# EAGLE design Tasmota_ESP32C6-6c (EAGLE 9.6.2)

## Sheet 1 of 8
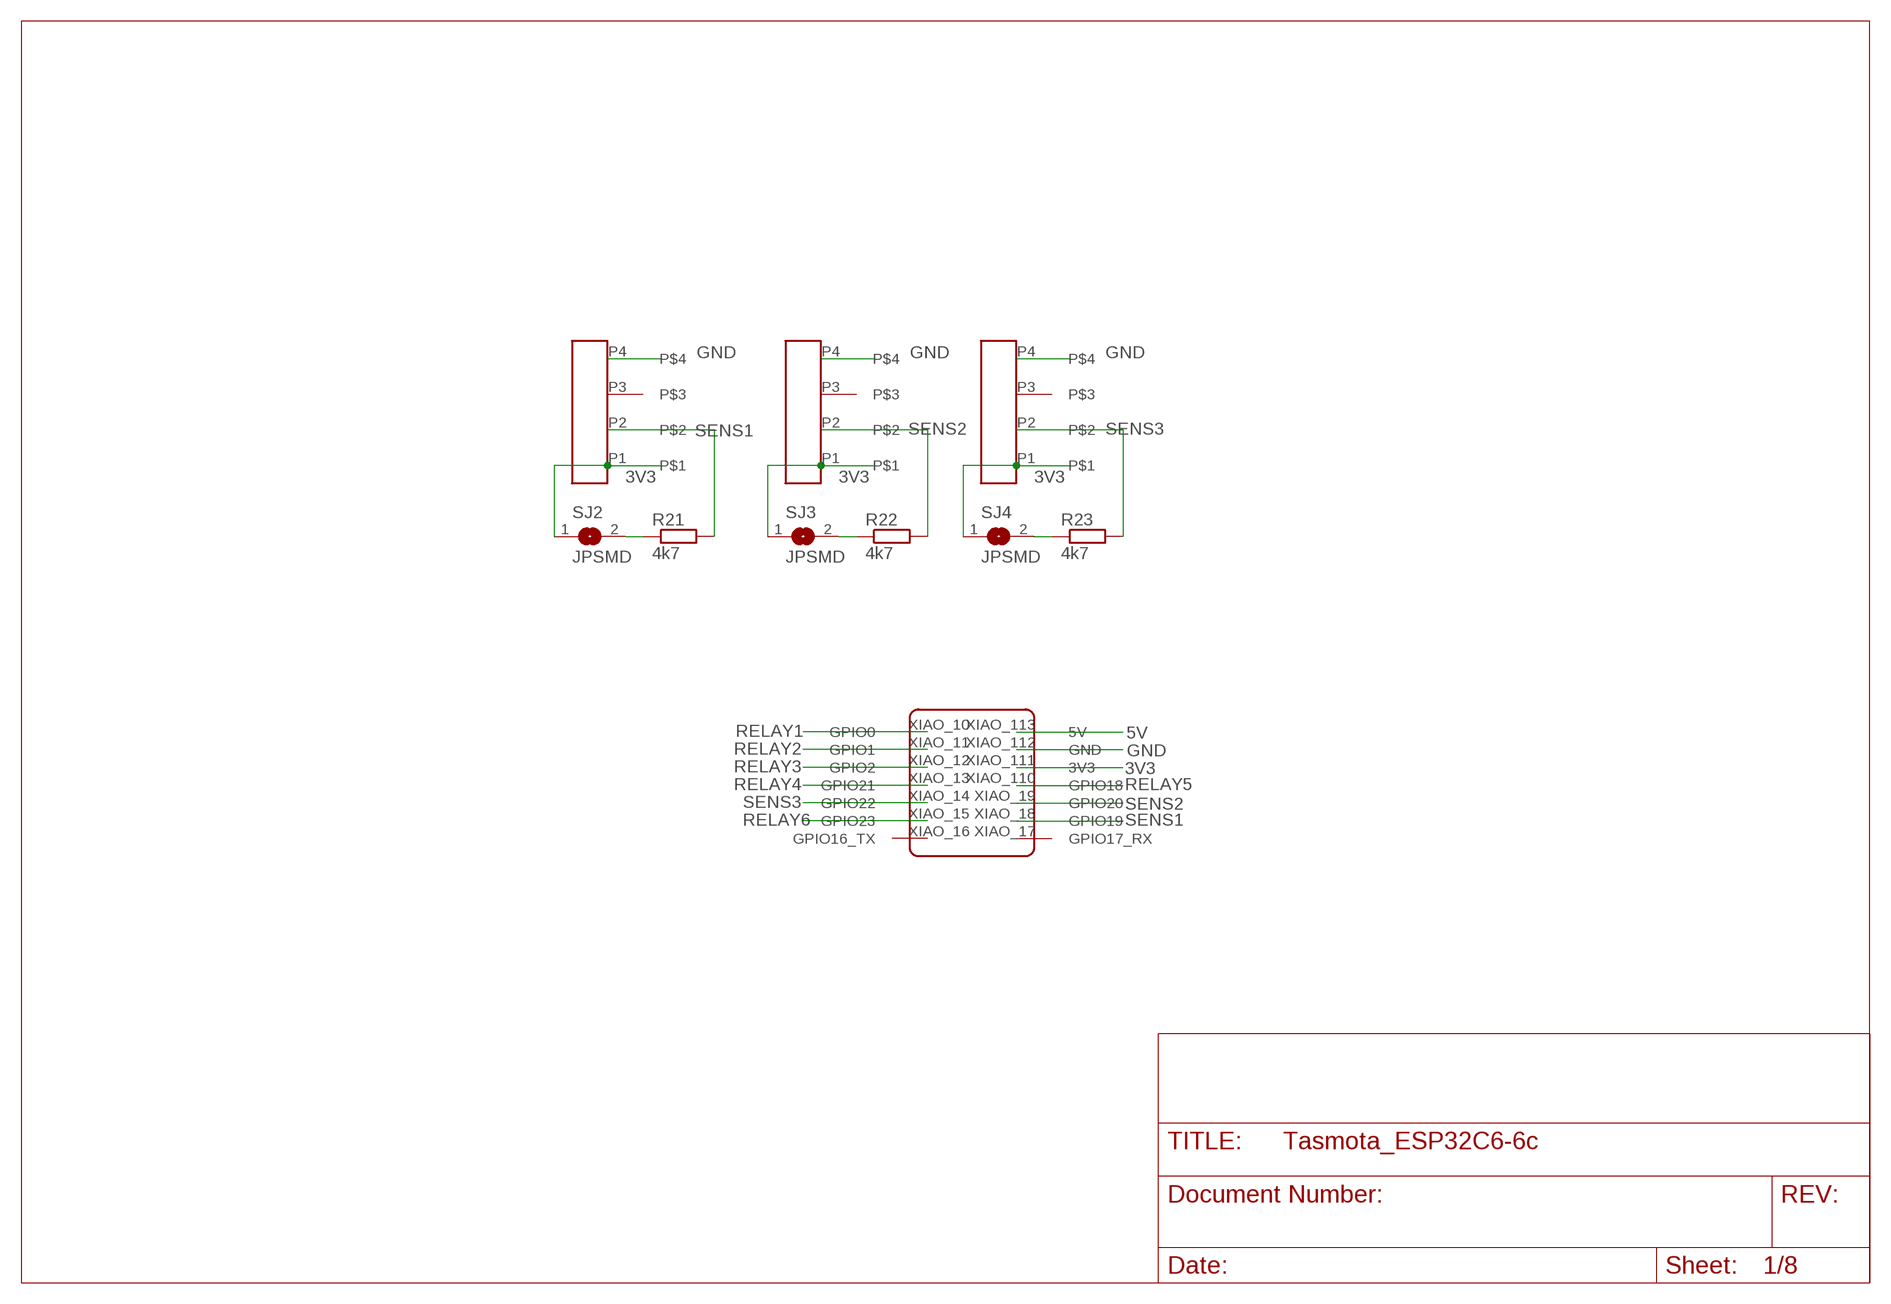
[diagram p0: schematic, sheet 1]

### Parts
R21  4k7  R-EU_R0805  [R0805]
R22  4k7  R-EU_R0805  [R0805]
R23  4k7  R-EU_R0805  [R0805]
SENSOR1  GMX-N-44  GMX-N-4  [GMX-N-4]
SENSOR2  GMX-N-44  GMX-N-4  [GMX-N-4]
SENSOR3  GMX-N-44  GMX-N-4  [GMX-N-4]
SJ2  JPSMD  SJ  [SJ]
SJ3  JPSMD  SJ  [SJ]
SJ4  JPSMD  SJ  [SJ]
U$1  1x7P  XIAO_ESP32C6  [XIAO_ESP32C6]

### Nets
3V3 [pwr]: SENSOR1.P1 SENSOR2.P1 SENSOR3.P1 SJ2.1 SJ3.1 SJ4.1 U$1.XIAO_111(3V3)
5V [pwr]: U$1.XIAO_113(5V) ; also sheet 2,3,4,5,6,7,8
GND [pwr]: SENSOR1.P4 SENSOR2.P4 SENSOR3.P4 U$1.XIAO_112(GND) ; also sheet 2,3,4,5,6,7,8
N$4: R21.1 SJ2.2
N$5: R22.1 SJ3.2
N$10: R23.1 SJ4.2
RELAY1: U$1.XIAO_10(GPIO0) ; also sheet 3
RELAY2: U$1.XIAO_11(GPIO1) ; also sheet 4
RELAY3: U$1.XIAO_12(GPIO2) ; also sheet 5
RELAY4: U$1.XIAO_13(GPIO21) ; also sheet 6
RELAY5: U$1.XIAO_110(GPIO18) ; also sheet 7
RELAY6: U$1.XIAO_15(GPIO23) ; also sheet 8
SENS1: R21.2 SENSOR1.P2 U$1.XIAO_18(GPIO19)
SENS2: R22.2 SENSOR2.P2 U$1.XIAO_19(GPIO20)
SENS3: R23.2 SENSOR3.P2 U$1.XIAO_14(GPIO22)
Unconnected: SENSOR1.P3 SENSOR2.P3 SENSOR3.P3 U$1.XIAO_16(GPIO16_TX) U$1.XIAO_17(GPIO17_RX)

## Sheet 2 of 8
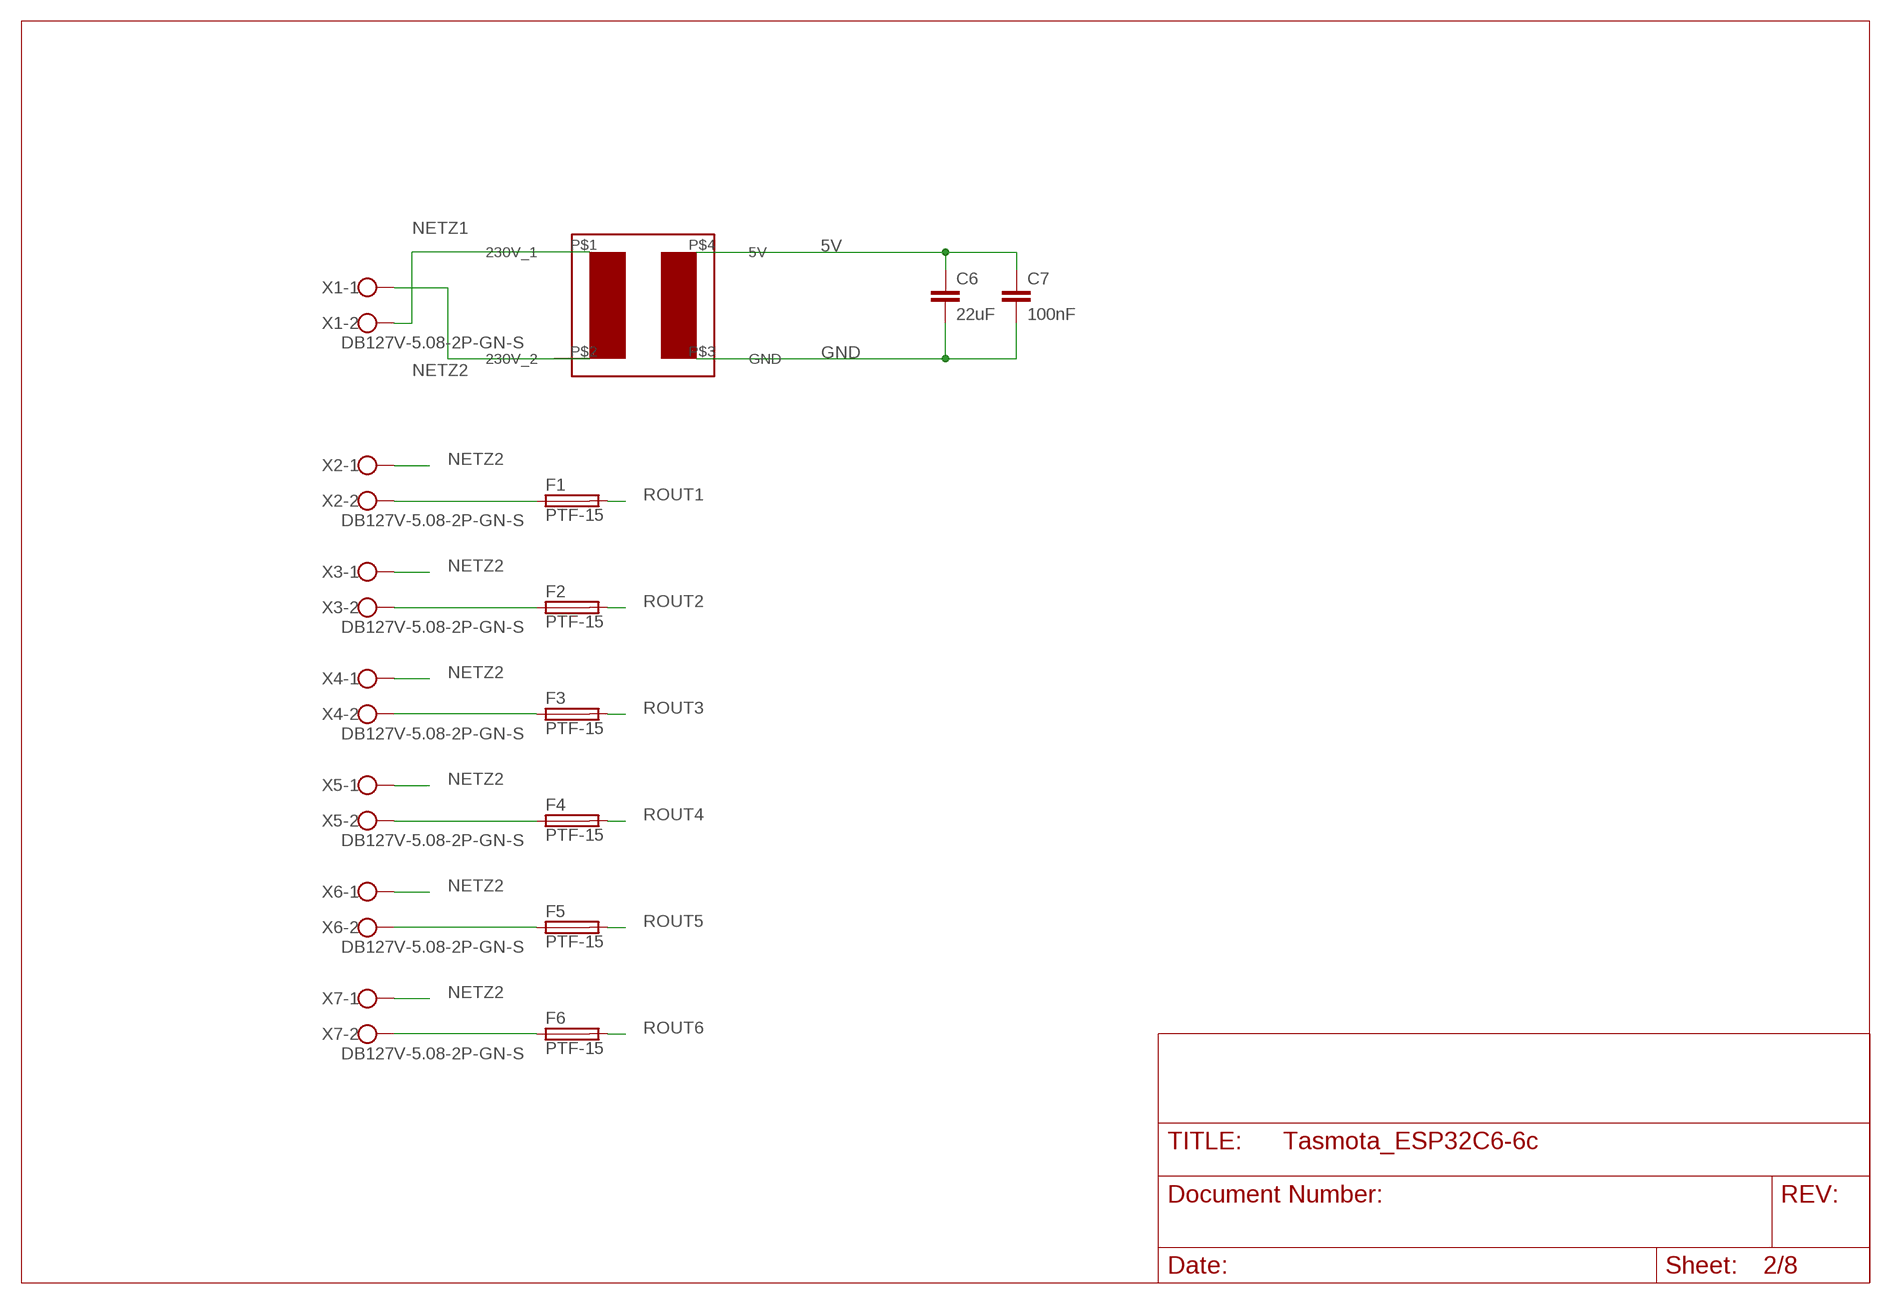
[diagram p1: schematic, sheet 2]

### Parts
C6  22uF  C-EUC0805  [C0805]
C7  100nF  C-EUC0805  [C0805]
F1  PTF-15  SH22,5  [SH22,5]
F2  PTF-15  SH22,5  [SH22,5]
F3  PTF-15  SH22,5  [SH22,5]
F4  PTF-15  SH22,5  [SH22,5]
F5  PTF-15  SH22,5  [SH22,5]
F6  PTF-15  SH22,5  [SH22,5]
U$3  HAW3-220S05T2  [HAW3-220S05T2]
X1  DB127V-5.08-2P-GN-S  W237-102  [W237-102]
X2  DB127V-5.08-2P-GN-S  W237-102  [W237-102]
X3  DB127V-5.08-2P-GN-S  W237-102  [W237-102]
X4  DB127V-5.08-2P-GN-S  W237-102  [W237-102]
X5  DB127V-5.08-2P-GN-S  W237-102  [W237-102]
X6  DB127V-5.08-2P-GN-S  W237-102  [W237-102]
X7  DB127V-5.08-2P-GN-S  W237-102  [W237-102]

### Nets
5V [pwr]: C6.1 C7.1 U$3.P$4(5V) ; also sheet 1,3,4,5,6,7,8
GND [pwr]: C6.2 C7.2 U$3.P$3(GND) ; also sheet 1,3,4,5,6,7,8
N$20: F1.1 X2.2
N$25: F2.1 X3.2
N$30: F3.1 X4.2
N$31: F4.1 X5.2
N$32: F5.1 X6.2
N$33: F6.1 X7.2
NETZ1 [main]: U$3.P$1(230V_1) X1.2 ; also sheet 3,4,5,6,7,8
NETZ2 [main]: U$3.P$2(230V_2) X1.1 X2.1 X3.1 X4.1 X5.1 X6.1 X7.1
ROUT1 [main]: F1.2 ; also sheet 3
ROUT2 [main]: F2.2 ; also sheet 4
ROUT3 [main]: F3.2 ; also sheet 5
ROUT4 [main]: F4.2 ; also sheet 6
ROUT5 [main]: F5.2 ; also sheet 7
ROUT6 [main]: F6.2 ; also sheet 8

## Sheet 3 of 8
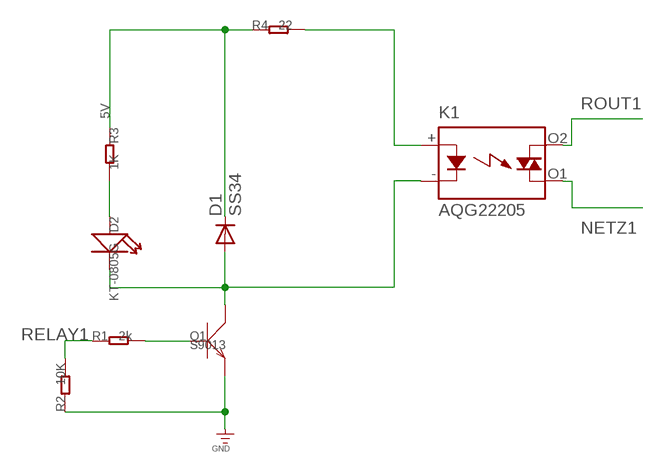
[diagram p2: schematic, sheet 3]

### Parts
D1  SS34  DIODE-DO-214AC  [DO-214AC]
D2  KT-0805G  LED'0805'  [LED-0805]
K1  AQG22205  [AQG]
Q1  S9013  TRANSISTOR-NPN-SOT23  [SOT23]
R1  2k  R-0805  [R0805]
R2  10K  R-0805  [R0805]
R3  1K  R-0805  [R0805]
R4  22  R-0805  [R0805]

### Nets
5V [pwr]: D1.C R3.1 R4.1 ; also sheet 1,2,4,5,6,7,8
GND [pwr]: Q1.2(E) R2.1 ; also sheet 1,2,4,5,6,7,8
N$1: Q1.1(B) R1.2
N$2: D1.A D2.- K1.-(K) Q1.3(C)
N$3: D2.+ R3.2
N$6: K1.+(A) R4.2
NETZ1 [main]: K1.O1(DS2) ; also sheet 2,4,5,6,7,8
RELAY1: R1.1 R2.2 ; also sheet 1
ROUT1 [main]: K1.O2(DS1) ; also sheet 2

## Sheet 4 of 8
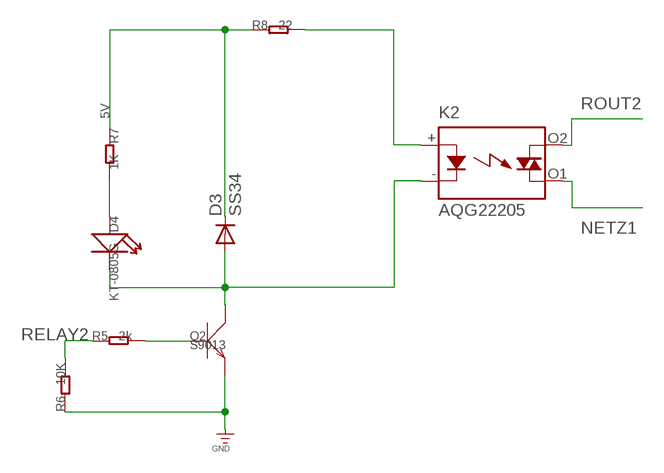
[diagram p3: schematic, sheet 4]

### Parts
D3  SS34  DIODE-DO-214AC  [DO-214AC]
D4  KT-0805G  LED'0805'  [LED-0805]
K2  AQG22205  [AQG]
Q2  S9013  TRANSISTOR-NPN-SOT23  [SOT23]
R5  2k  R-0805  [R0805]
R6  10K  R-0805  [R0805]
R7  1K  R-0805  [R0805]
R8  22  R-0805  [R0805]

### Nets
5V [pwr]: D3.C R7.1 R8.1 ; also sheet 1,2,3,5,6,7,8
GND [pwr]: Q2.2(E) R6.1 ; also sheet 1,2,3,5,6,7,8
N$11: Q2.1(B) R5.2
N$12: D3.A D4.- K2.-(K) Q2.3(C)
N$13: D4.+ R7.2
N$14: K2.+(A) R8.2
NETZ1 [main]: K2.O1(DS2) ; also sheet 2,3,5,6,7,8
RELAY2: R5.1 R6.2 ; also sheet 1
ROUT2 [main]: K2.O2(DS1) ; also sheet 2

## Sheet 5 of 8
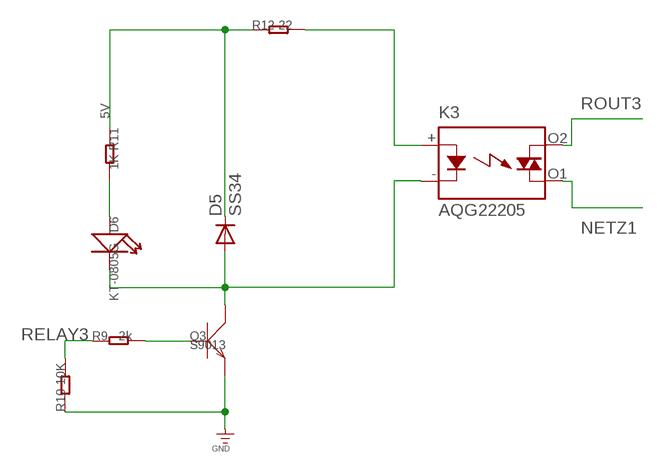
[diagram p4: schematic, sheet 5]

### Parts
D5  SS34  DIODE-DO-214AC  [DO-214AC]
D6  KT-0805G  LED'0805'  [LED-0805]
K3  AQG22205  [AQG]
Q3  S9013  TRANSISTOR-NPN-SOT23  [SOT23]
R9  2k  R-0805  [R0805]
R10  10K  R-0805  [R0805]
R11  1K  R-0805  [R0805]
R12  22  R-0805  [R0805]

### Nets
5V [pwr]: D5.C R11.1 R12.1 ; also sheet 1,2,3,4,6,7,8
GND [pwr]: Q3.2(E) R10.1 ; also sheet 1,2,3,4,6,7,8
N$16: Q3.1(B) R9.2
N$17: D5.A D6.- K3.-(K) Q3.3(C)
N$18: D6.+ R11.2
N$19: K3.+(A) R12.2
NETZ1 [main]: K3.O1(DS2) ; also sheet 2,3,4,6,7,8
RELAY3: R9.1 R10.2 ; also sheet 1
ROUT3 [main]: K3.O2(DS1) ; also sheet 2

## Sheet 6 of 8
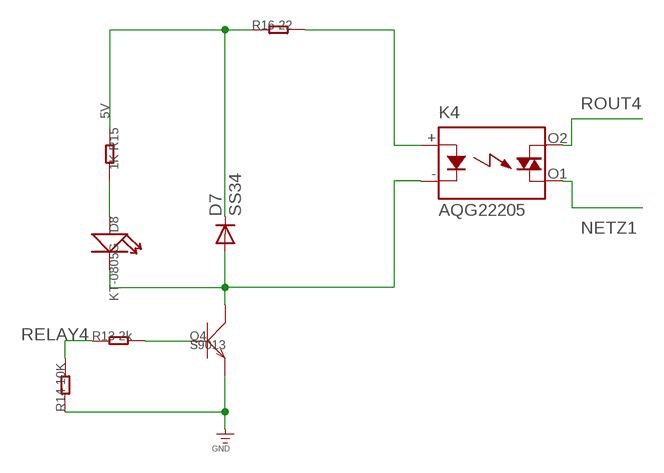
[diagram p5: schematic, sheet 6]

### Parts
D7  SS34  DIODE-DO-214AC  [DO-214AC]
D8  KT-0805G  LED'0805'  [LED-0805]
K4  AQG22205  [AQG]
Q4  S9013  TRANSISTOR-NPN-SOT23  [SOT23]
R13  2k  R-0805  [R0805]
R14  10K  R-0805  [R0805]
R15  1K  R-0805  [R0805]
R16  22  R-0805  [R0805]

### Nets
5V [pwr]: D7.C R15.1 R16.1 ; also sheet 1,2,3,4,5,7,8
GND [pwr]: Q4.2(E) R14.1 ; also sheet 1,2,3,4,5,7,8
N$21: Q4.1(B) R13.2
N$22: D7.A D8.- K4.-(K) Q4.3(C)
N$23: D8.+ R15.2
N$24: K4.+(A) R16.2
NETZ1 [main]: K4.O1(DS2) ; also sheet 2,3,4,5,7,8
RELAY4: R13.1 R14.2 ; also sheet 1
ROUT4 [main]: K4.O2(DS1) ; also sheet 2

## Sheet 7 of 8
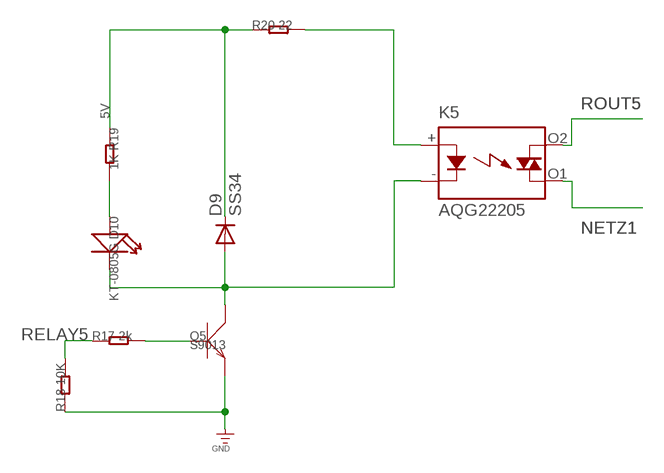
[diagram p6: schematic, sheet 7]

### Parts
D9  SS34  DIODE-DO-214AC  [DO-214AC]
D10  KT-0805G  LED'0805'  [LED-0805]
K5  AQG22205  [AQG]
Q5  S9013  TRANSISTOR-NPN-SOT23  [SOT23]
R17  2k  R-0805  [R0805]
R18  10K  R-0805  [R0805]
R19  1K  R-0805  [R0805]
R20  22  R-0805  [R0805]

### Nets
5V [pwr]: D9.C R19.1 R20.1 ; also sheet 1,2,3,4,5,6,8
GND [pwr]: Q5.2(E) R18.1 ; also sheet 1,2,3,4,5,6,8
N$26: Q5.1(B) R17.2
N$28: D10.+ R19.2
N$29: K5.+(A) R20.2
N$34: D9.A D10.- K5.-(K) Q5.3(C)
NETZ1 [main]: K5.O1(DS2) ; also sheet 2,3,4,5,6,8
RELAY5: R17.1 R18.2 ; also sheet 1
ROUT5 [main]: K5.O2(DS1) ; also sheet 2

## Sheet 8 of 8
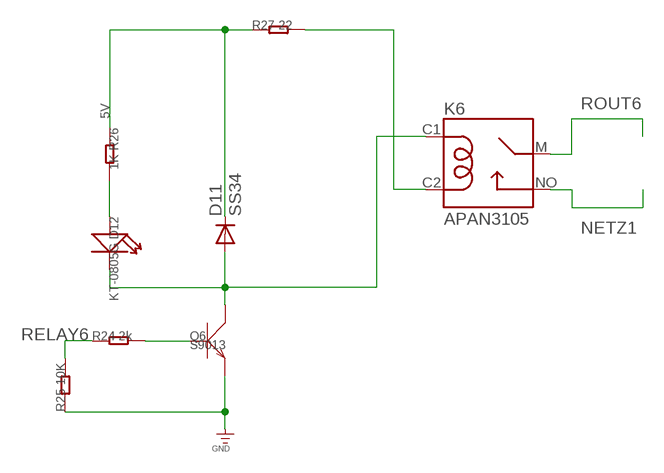
[diagram p7: schematic, sheet 8]

### Parts
D11  SS34  DIODE-DO-214AC  [DO-214AC]
D12  KT-0805G  LED'0805'  [LED-0805]
K6  APAN3105  [RELAY_APAN3105]
Q6  S9013  TRANSISTOR-NPN-SOT23  [SOT23]
R24  2k  R-0805  [R0805]
R25  10K  R-0805  [R0805]
R26  1K  R-0805  [R0805]
R27  22  R-0805  [R0805]

### Nets
5V [pwr]: D11.C R26.1 R27.1 ; also sheet 1,2,3,4,5,6,7
GND [pwr]: Q6.2(E) R25.1 ; also sheet 1,2,3,4,5,6,7
N$7: Q6.1(B) R24.2
N$8: D11.A D12.- K6.C1 Q6.3(C)
N$9: D12.+ R26.2
N$15: K6.C2 R27.2
NETZ1 [main]: K6.NO ; also sheet 2,3,4,5,6,7
RELAY6: R24.1 R25.2 ; also sheet 1
ROUT6 [main]: K6.M ; also sheet 2

## Library data of the parts
C6 C7 = rcl:C-EU: CAPACITOR, European symbol; SPICEPREFIX: C
D1 D3 D5 D7 D9 D11 = diode:DIODE-: DIODE
D2 D4 D6 D8 D10 D12 = Discrete:LED*
F1-F6 = MK312parts:SH22,5: FUSE HOLDER grid 22,5 mm, OGN0031 8201, Schurter (Buerklin); MF: SCHURTER; MPN: 0031.8201; OC_FARNELL: 1162740; OC_NEWARK: 96F8317
K1-K5 = relay:AQG*: SOLID STATE RELAY NAiS Zero-cross, Non zero-cross Source: http://www.mew-europe.com/.. en_ds_61611_0000.pdf; MPN: AQG22205; OC_FARNELL: unknown; OC_NEWARK: 11N2587
K6 = MK312parts:APAN3105: Check availability <https://pricing.snapeda.com/parts/APAN3105/Panasonic/view-part?ref=eda>; AVAILABILITY: In Stock; CHECK_PRICES: https://www.snapeda.com/parts/APAN3105/Panasonic+Electric+Works/view-part/?ref=eda; DESCRIPTION: PA-N Relay 5V 1FormA, 5A@250VAC, 30VDC | Panasonic Electronic Components APAN3105; MF: Panasonic; MP: APAN3105; PACKAGE: None; PRICE: None; SNAPEDA_LINK: https://www.snapeda.com/parts/APAN3105/Panasonic+Electric+Works/view-part/?ref=snap
Q1-Q6 = Discrete:TRANSISTOR-NPN*: NPN audion
R1-R20 R24-R27 = Discrete:R*
R21-R23 = rcl:R-EU_: RESISTOR, European symbol; SPICEPREFIX: R
SENSOR1-SENSOR3 = MK312parts:GMX-N-4
SJ2-SJ4 = jumper:SJ: SMD solder JUMPER
U$1 = MK312parts:XIAO_ESP32C6
U$3 = MK312parts:HAW3-220S05T2
X1 = con-wago-500:W237-102: WAGO SCREW CLAMP; MPN: 237-102; OC_FARNELL: unknown; OC_NEWARK: 70K9898
X2-X7 = MK312parts:W237-102: WAGO SCREW CLAMP; MPN: 237-102; OC_FARNELL: unknown; OC_NEWARK: 70K9898

## Net classes
0 default: width 0.35 mm, drill 0.4 mm, clearance 0.2 mm
1 pwr: width 0.4 mm, drill 0.5 mm, clearance 0.2 mm
2 main: width 1 mm, drill 0.6 mm, clearance 2 mm

## Board
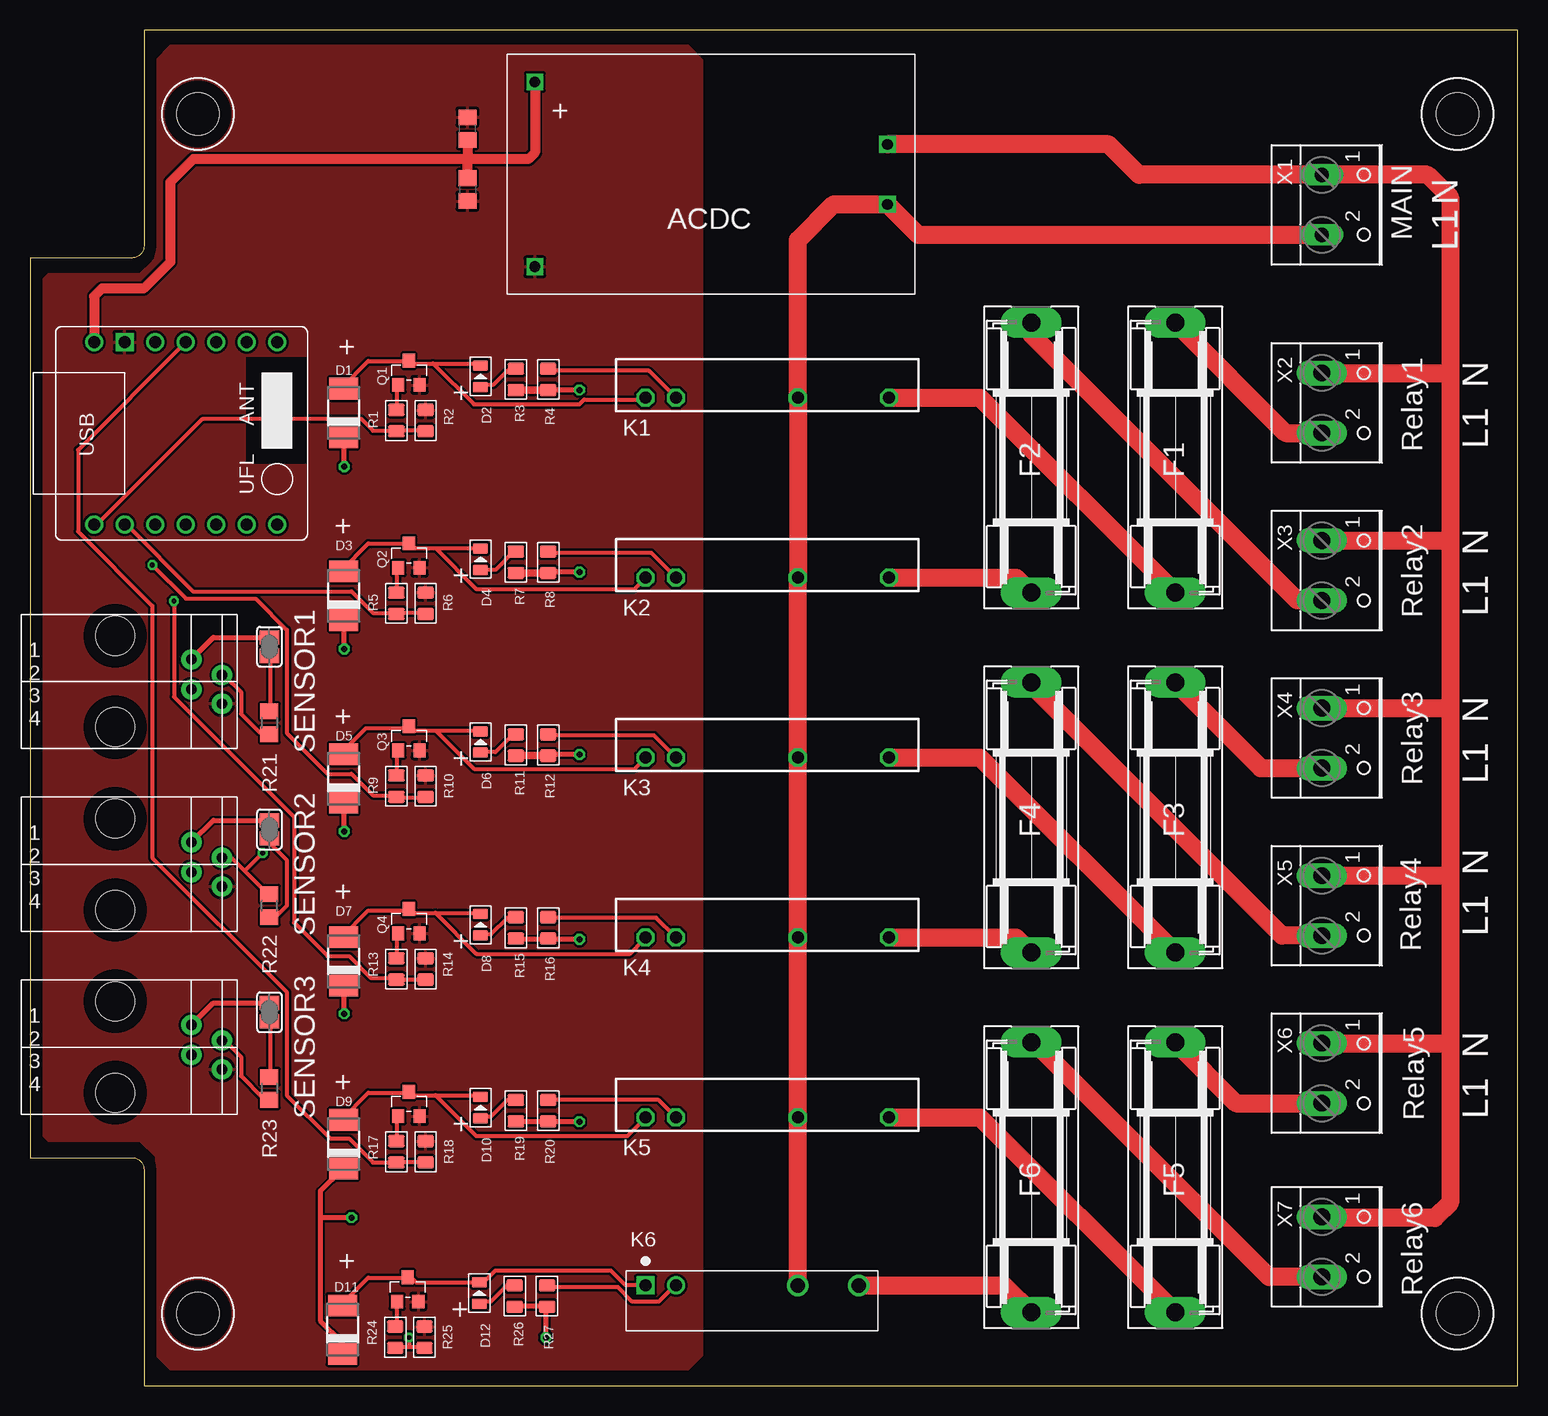
[diagram p8: board, top side]
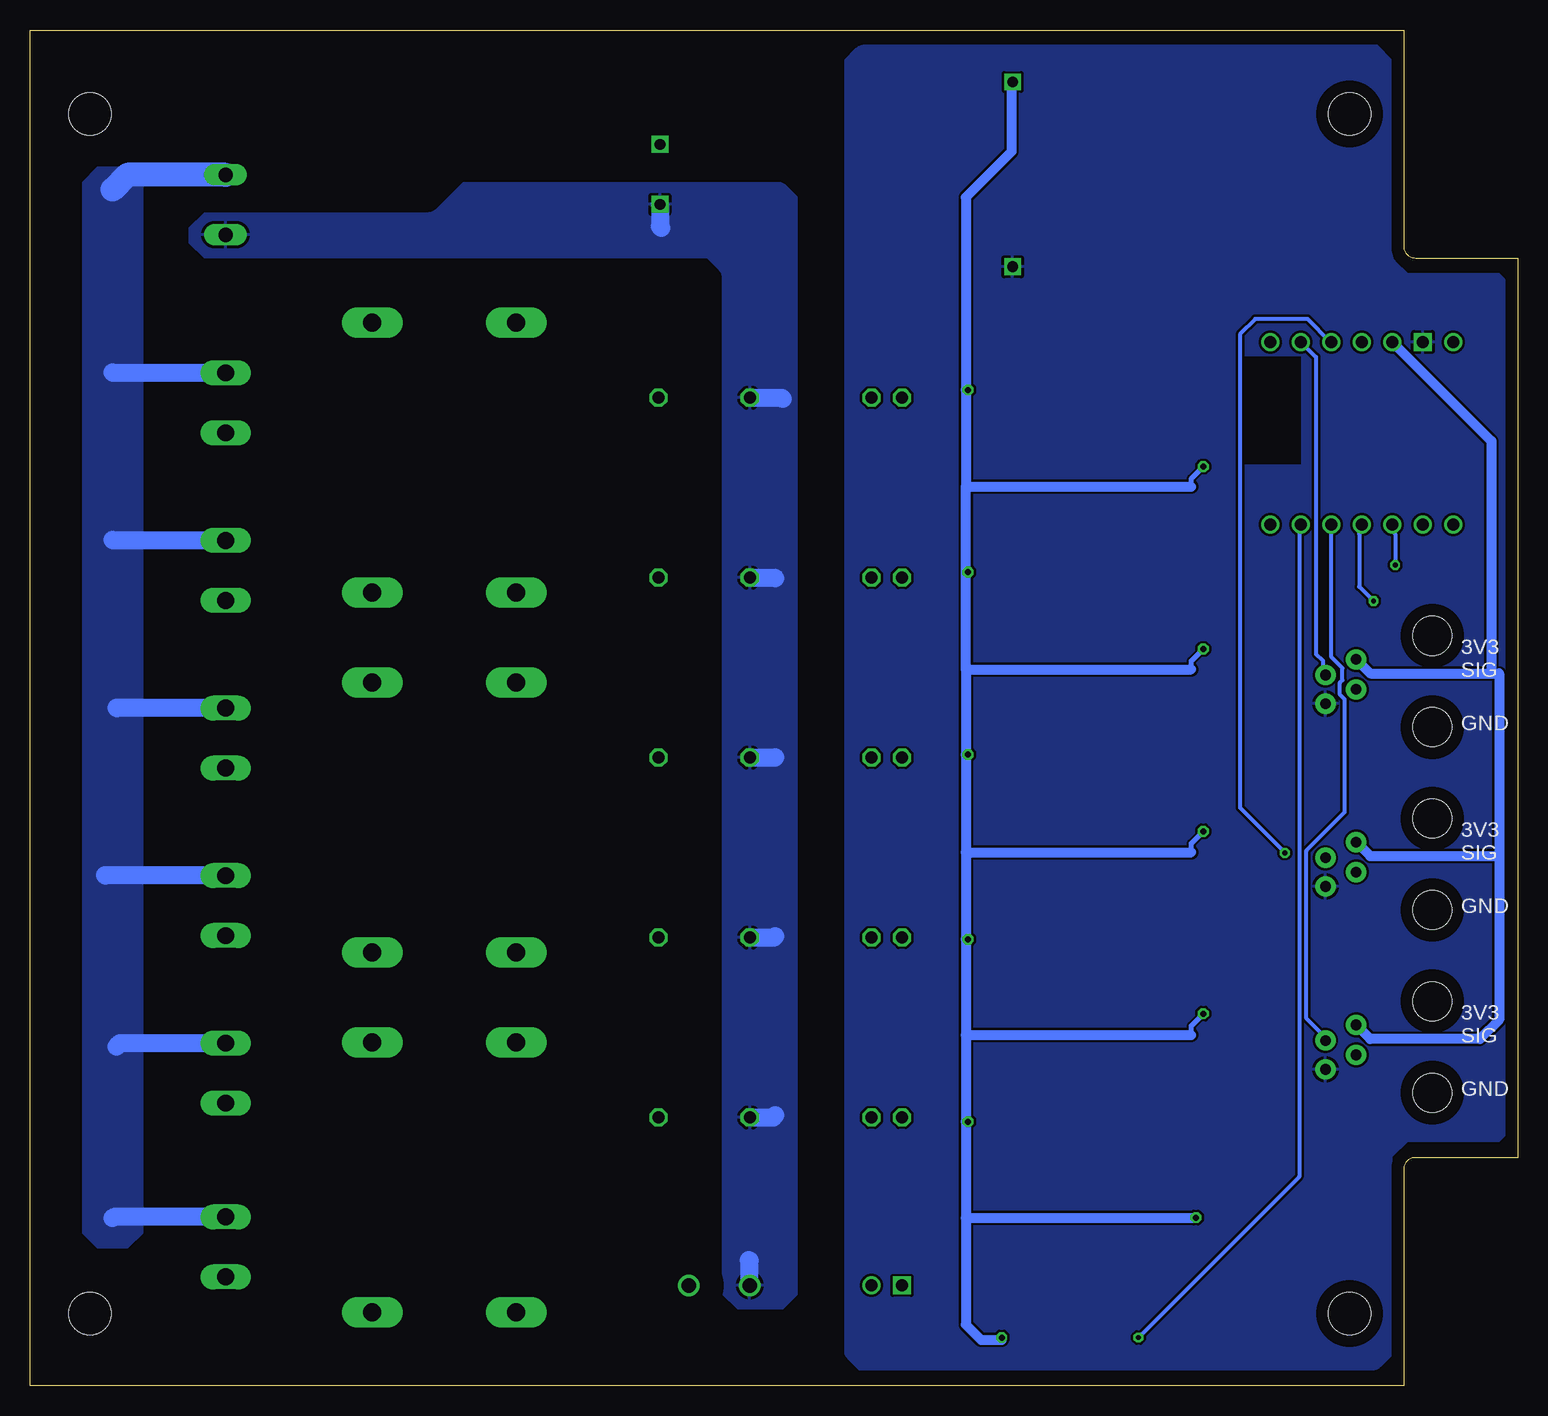
[diagram p9: board, bottom side, seen from below]

Size 124 x 113 mm. Coordinates in mm from the lower left corner, seen from the top.
Outline: 9.5,0 124,0 124,113 9.5,113 9.5,95 arc-90 8.5,94 0,94 0,19 8.5,19 arc-90 9.5,18 9.5,0
Copper layers (1*16): Top 0.035mm / dielectric 1.5mm / Bottom 0.035mm
Design rules "default": minimum track width 6mil, minimum drill 0.35mm, track to track 6mil, track to pad 6mil, pad to pad 6mil, via to via 6mil, smd to smd 6mil, copper to edge 40mil, drill to drill 6mil, minimum pad ring 10mil, minimum via ring 8mil, stop-mask expansion 4mil, vias tented up to drill 0mil, thermal gap 10mil
Holes 3.5 mm at 119,106 119,6 14,106 14,6
tRestrict: area 56.1,0 to 60,111.3
bRestrict: area 56.1,0 to 60,111.3

### Footprints (pad centres in the part's own frame; a part is rotated, then mirrored left to right if it is on the bottom)
C0805 = smd 1.3 x 1.5: 1 -0.95,0; 2 0.95,0
DO-214AC = smd 1.8 x 2.4: A 2.025,0; C -2.025,0
LED-0805 = smd 0.889 x 1.27: + -0.889,0; - 0.889,0
SH22,5 = drill 1.5 pad 2.54 long: 1 -11.252,0; 2 11.252,0
AQG = drill 1 octagon: + -7.62,0; - -10.16,0; O1 2.54,0; O2 10.16,0
RELAY_APAN3105 = drill 1 square: C1 0,0 | drill 1: C2 2.54,0 | drill 1.2: M 17.78,0; NO 12.7,0
SOT23 = smd 1.016 x 1.143: 1 -0.889,-1.016; 2 0.889,-1.016; 3 0,1.016
R0805 = smd 1.016 x 1.397: 1 -0.889,0; 2 0.889,0
R0805' = smd 1.3 x 1.5: 1 -0.95,0; 2 0.95,0
GMX-N-4 = drill 0.9 pad 1.676: P1 14.2,7.45; P2 16.75,6.15; P3 14.2,4.95; P4 16.75,3.75 | hole 3.25: 7.85,1.8; 7.85,9.42
SJ = smd 1.168 x 1.6: 1 -0.762,0; 2 0.762,0
XIAO_ESP32C6 = drill 1: XIAO_10 1.27,17.78; XIAO_11 1.27,15.24; XIAO_12 1.27,12.7; XIAO_13 1.27,10.16; XIAO_14 1.27,7.62; XIAO_15 1.27,5.08; XIAO_16 1.27,2.54; XIAO_17 16.51,2.54; XIAO_18 16.51,5.08; XIAO_19 16.51,7.62; XIAO_110 16.51,10.16; XIAO_111 16.51,12.7; XIAO_113 16.51,17.78 | drill 1 square: XIAO_112 16.51,15.24
HAW3-220S05T2 = drill 0.9 square: P$1 -14.7,2.5; P$2 -14.7,-2.5; P$3 14.7,7.7; P$4 14.7,-7.7
W237-102 = drill 1.194 long: 1 -2.5,-1.27; 2 2.5,-1.27
W237-102' = drill 1.4 long: 1 -2.5,-1.27; 2 2.5,-1.27

### Placement (x,y rotation side)
C6  36.47,104.78 90 top
C7  36.47,99.69 270 top
D1  26.15,81.08 90 top
D2  37.56,84.12 90 top
D3  26.15,65.84 90 top
D4  37.56,68.88 90 top
D5  26.15,50.6 90 top
D6  37.56,53.64 90 top
D7  26.15,35.36 90 top
D8  37.56,38.4 90 top
D9  26.15,20.12 90 top
D10  37.56,23.16 90 top
D11  26.05,4.66 90 top
D12  37.46,7.7 90 top
F1  95.46,77.35 270 top
F2  83.46,77.35 270 top
F3  95.46,47.35 270 top
F4  83.46,47.35 270 top
F5  95.46,17.35 270 top
F6  83.46,17.35 270 top
K1  61.46,82.35 0 top
K2  61.46,67.35 0 top
K3  61.46,52.35 0 top
K4  61.46,37.35 0 top
K5  61.46,22.35 0 top
K6  51.31,8.35 0 top
Q1  31.59,84.43 0 top
Q2  31.59,69.19 0 top
Q3  31.59,53.95 0 top
Q4  31.59,38.71 0 top
Q5  31.59,23.47 0 top
Q6  31.49,8.01 0 top
R1  30.55,80.44 90 top
R2  32.99,80.44 270 top
R3  40.5,83.87 90 top
R4  43.2,83.87 90 top
R5  30.55,65.2 90 top
R6  32.99,65.2 270 top
R7  40.5,68.63 90 top
R8  43.2,68.63 90 top
R9  30.55,49.96 90 top
R10  32.99,49.96 270 top
R11  40.5,53.39 90 top
R12  43.2,53.39 90 top
R13  30.55,34.72 90 top
R14  32.99,34.72 270 top
R15  40.5,38.15 90 top
R16  43.2,38.15 90 top
R17  30.55,19.48 90 top
R18  32.99,19.48 270 top
R19  40.5,22.91 90 top
R20  43.2,22.91 90 top
R21  4k7  [R0805']  19.95,55.24 270 top
R22  4k7  [R0805']  19.95,40.01 90 top
R23  4k7  [R0805']  19.95,24.77 270 top
R24  30.45,4.02 90 top
R25  32.89,4.02 270 top
R26  40.4,7.45 90 top
R27  43.1,7.45 90 top
SENSOR1  -0.75,53.09 0 top
SENSOR2  -0.75,37.85 0 top
SENSOR3  -0.75,22.61 0 top
SJ2  19.95,61.59 270 top
SJ3  19.95,46.35 270 top
SJ4  19.95,31.11 270 top
U$1  23.13,70.48 90 top
U$3  56.78,100.97 180 top
X1  108.96,98.42 270 top
X2  DB127V-5.08-2P-GN-S  [W237-102']  108.96,81.92 270 top
X3  DB127V-5.08-2P-GN-S  [W237-102']  108.96,67.94 270 top
X4  DB127V-5.08-2P-GN-S  [W237-102']  108.96,53.98 270 top
X5  DB127V-5.08-2P-GN-S  [W237-102']  108.96,40.01 270 top
X6  DB127V-5.08-2P-GN-S  [W237-102']  108.96,26.04 270 top
X7  DB127V-5.08-2P-GN-S  [W237-102']  108.96,11.56 270 top

### Tracks (layer width: path | path; a pad name or v marks a point on that pad's centre or on a via)
3V3
  Top 0.406: SENSOR1.P1 15.27,62.36 SJ2.1 | SENSOR2.P1 15.27,47.12 SJ3.1 | SENSOR3.P1 15.27,31.88 SJ4.1
  Bottom 0.813: U$1.XIAO_111 2.17,78.74 2.17,59.37 | SENSOR3.P1 12.29,28.89 3.13,28.89 1.54,30.48 1.54,44.13 | 1.54,44.13 1.54,59.37 2.17,59.37 | SENSOR2.P1 12.29,44.13 1.54,44.13 | SENSOR1.P1 12.29,59.37 2.17,59.37
5V  (via drill 0.5)
  Top 0.4: 24.2,14 24.2,16.2 26,18 D9.C | 24.2,14 24.2,5.4 26,3.6 26,2.8 D11.C | R15.1 40.6,37.2 43,37.2 R16.1 43.2,37.2 v45.8,37.2 | R19.1 40.6,22 43,22 R20.1 43.2,22 v45.8,22 | R26.1 40.6,6.6 43,6.6 R27.1 43,6.4 v43,4 | v45.8,52.6 43.4,52.6 R12.1 | v45.8,67.8 43.4,67.8 R8.1 | v45.8,83 43.4,83 R4.1 | v26.2,31 26.2,33.2 D7.C | v26.2,46.2 26.2,48.4 D5.C | v26.2,61.4 26.2,63.8 D3.C | v26.2,76.6 26.2,79 D1.C | v26.8,14 24.2,14
  Top 0.61: R3.1 R4.1 | R7.1 R8.1 | R11.1 R12.1
  Top 0.813: C6.1 36.47,102.23 | C7.1 36.47,102.23 | U$3.P$4 42.09,102.78 41.55,102.23 36.47,102.23 | 36.47,102.23 13.61,102.23 11.7,100.33 11.7,93.66 9.48,91.44 5.99,91.44 5.35,90.81 U$1.XIAO_113
  Bottom 0.4: v43,4 43,3.81 | v45.8,22 45.99,22 | v45.8,37.2 45.99,37.2 | v45.8,52.6 45.99,52.6 | v45.8,67.8 45.99,67.8 | v45.8,83 45.99,83 | v26.2,31 27.2,30 27.2,29.21 | v26.2,46.2 27.2,45.2 27.2,44.45 | v26.2,61.4 27.2,60.4 27.2,59.69 | v26.2,76.6 27.2,75.6 27.2,74.93 | v26.8,14 26.94,13.97
  Bottom 0.813: U$3.P$4 42.18,108.57 42.18,102.87 45.99,99.06 45.99,83 45.99,74.93 | 43,3.81 44.72,3.81 45.99,5.08 45.99,13.97 | 45.99,59.69 45.99,67.8 45.99,74.93 | 45.99,59.69 45.99,52.6 45.99,44.45 | 45.99,44.45 45.99,37.2 45.99,29.21 | 45.99,29.21 45.99,22 45.99,13.97 | 45.99,13.97 26.94,13.97 | 45.99,29.21 27.2,29.21 | 45.99,44.45 27.2,44.45 | 45.99,59.69 27.2,59.69 | 45.99,74.93 27.2,74.93
GND
  cutout Bottom: 18.05,85.72 23.13,85.72 23.13,76.83 18.05,76.83
  cutout Top: 18.05,85.72 23.13,85.72 23.13,76.83 18.05,76.83
  pour Top: 54.88,1.27 56.15,2.54 56.15,110.49 54.88,111.76 11.7,111.76 10.43,110.49 10.43,94.39 arc-45 10.14,93.69 9.16,92.71 1.54,92.71 0.27,91.44 0.27,22 arc45 0.56,21.3 1.54,20.32 9.16,20.32 10.43,19.05 10.43,2.54 11.7,1.27
  pour Bottom: 10.43,110.49 11.7,111.76 54.47,111.76 arc-45 55.17,111.47 56.15,110.49 56.15,2.95 arc-45 55.86,2.25 54.88,1.27 12.11,1.27 arc-45 11.41,1.56 10.43,2.54 10.43,19.05 9.16,20.32 1.54,20.32 0.27,21.59 0.27,91.03 arc-45 0.56,91.73 1.54,92.71 9.16,92.71 10.14,93.69 arc45 10.43,94.39
N$1
  Top 0.35: Q1.1 30.6,83.4 30.6,81.4 R1.2
N$2
  Top 0.35: D1.A 26,83.2 28.2,85.4 31.4,85.4 Q1.3 31.6,85.4 31.8,85.2 33.6,85.2 | 33.6,85.2 37.4,85.2 D2.- | 33.6,85.2 37,81.8 45.8,81.8 46.2,82.2 51.2,82.2 K1.-
N$3
  Top 0.35: D2.+ 37.6,83.4 38.6,83.4 39.8,84.6 40.4,84.6 R3.2
N$4
  Top 0.35: R21.1 20,56.2 20,60.8 SJ2.2
N$5
  Top 0.35: R22.1 20,39.2 20.6,39.2 21.4,40 21.4,43.8 19.8,45.4 SJ3.2
N$6
  Top 0.35: R4.2 43.2,84.6 51.6,84.6 53.8,82.4 K1.+
N$7
  Top 0.35: Q6.1 30.6,6.8 30.6,5 R24.2
N$8
  Top 0.35: D11.A 26,6.8 28.2,9 31.4,9 Q6.3 31.6,9.2 32.2,8.6 37.4,8.6 D12.- 37.6,8.4 38.8,9.6 48.4,9.6 49.6,8.4 51.2,8.4 K6.C1
N$9
  Top 0.35: D12.+ 37.6,7 38.4,7 39.8,8.4 40.4,8.4 R26.2
N$10
  Top 0.35: R23.1 20,25.8 20,30.2 SJ4.2
N$11
  Top 0.35: Q2.1 30.6,68 30.6,66.2 R5.2
N$12
  Top 0.35: D3.A 26,68 28.2,70.2 31.4,70.2 Q2.3 32,69.8 33.8,69.8 | 33.8,69.8 37.4,69.8 D4.- | 33.8,69.8 37.2,66.4 50.4,66.4 51.2,67.2 K2.-
N$13
  Top 0.35: D4.+ 37.6,68 38.8,68 40.4,69.6 R7.2
N$14
  Top 0.35: R8.2 43.2,69.4 51.8,69.4 53.8,67.4 K2.+
N$15
  Top 0.35: R27.2 43.2,8.2 49,8.2 50.2,7 52.4,7 53.8,8.4 K6.C2
N$16
  Top 0.35: Q3.1 30.6,52.8 30.6,51 R9.2
N$17
  Top 0.35: D5.A 26,52.8 28,54.8 31.4,54.8 Q3.3 31.6,54.8 31.8,54.6 33.8,54.6 | 33.8,54.6 37.4,54.6 D6.- | 33.8,54.6 37,51.4 50.4,51.4 51.2,52.2 K3.-
N$18
  Top 0.35: D6.+ 37.6,52.8 38.8,52.8 40.4,54.4 R11.2
N$19
  Top 0.35: R12.2 43.2,54.2 52,54.2 53.8,52.4 K3.+
N$20
  Top 1.5: F1.1 104.65,79.42 X2.2
N$21
  Top 0.35: Q4.1 30.6,37.6 30.6,35.8 R13.2
N$22
  Top 0.35: D7.A 26,37.4 28.2,39.6 31.4,39.6 Q4.3 31.6,39.6 31.8,39.4 33.8,39.4 | 33.8,39.4 37.4,39.4 D8.- | 33.8,39.4 37.2,36 50,36 51.2,37.2 K4.-
N$23
  Top 0.35: D8.+ 37.6,37.6 38.4,37.6 39.8,39 40.4,39 R15.2
N$24
  Top 0.35: R16.2 43.2,39 52.2,39 53.8,37.4 K4.+
N$25
  Top 1.5: X3.2 105.64,65.44 83.46,87.62 F2.1
N$26
  Top 0.35: Q5.1 30.6,22.4 30.6,20.4 R17.2
N$28
  Top 0.35: D10.+ 37.6,22.4 38.4,22.4 39.8,23.8 40.4,23.8 R19.2
N$29
  Top 0.35: R20.2 52.4,23.8 53.8,22.4 K5.+
N$30
  Top 1.5: F3.1 102.59,51.48 X4.2
N$31
  Top 1.5: X5.2 104.37,37.51 83.46,58.41 F4.1
N$32
  Top 1.5: F5.1 100.53,23.54 X6.2
N$33
  Top 1.5: X7.2 103.29,9.06 83.75,28.6 F6.1
N$34
  Top 0.35: D9.A 26,22.2 28.2,24.4 31.4,24.4 Q5.3 31.6,24.4 31.8,24.2 33.8,24.2 | 33.8,24.2 37.4,24.2 D10.- | 33.8,24.2 37.2,20.8 49.8,20.8 51.2,22.2 K5.-
NETZ1
  Top 1.5: K6.NO K5.O1 K4.O1 K3.O1 K2.O1 K1.O1 64,95.48 66.98,98.47 U$3.P$1 74.03,95.92 X1.2
  Bottom 1.5: U$3.P$1 71.48,96.61 71.39,96.52 | K1.O1 61.35,82.35 61.23,82.23 | K2.O1 61.91,67.35 61.87,67.31 | K3.O1 61.9,52.35 61.87,52.39 | K4.O1 61.98,37.35 61.87,37.47 | K5.O1 62.06,22.35 61.87,22.54 | K6.NO 64.01,10.4 64.09,10.48
  pour Bottom: 59.96,7.62 61.23,6.35 65.04,6.35 66.31,7.62 66.31,92.3 arc-45 66.6,93 67.58,93.98 109.49,93.98 110.76,95.25 110.76,96.52 109.49,97.79 90.85,97.79 arc-45 90.15,98.08 87.9,100.33 61.64,100.33 arc45 60.94,100.04 59.96,99.06
NETZ2
  Top 1.5: U$3.P$2 89.91,103.47 92.45,100.92 X1.1 116.52,100.92 118.38,99.06 118.38,84.77 | X7.1 107.78,13.97 117.11,13.97 118.38,15.24 118.38,28.57 | 118.38,84.77 118.38,70.48 | 118.38,70.48 118.38,56.83 | 118.38,56.83 118.38,42.86 | 118.38,42.86 118.38,28.57 | X6.1 118.34,28.54 118.38,28.57 | X5.1 118.02,42.51 118.38,42.86 | X4.1 118.02,56.48 118.38,56.83 | X3.1 118.34,70.44 118.38,70.48 | X2.1 118.02,84.42 118.38,84.77
  Bottom 1.5: X2.1 117.07,84.42 117.11,84.45 | X3.1 117.07,70.44 117.11,70.48 | X4.1 116.75,56.48 116.79,56.52 | X5.1 117.7,42.51 117.75,42.55 | X6.1 116.52,28.54 116.79,28.26 | X7.1 117.02,14.06 117.11,13.97
  Bottom 2: 117.11,99.69 115.88,100.92 X1.1
  pour Bottom: 114.57,12.7 115.84,11.43 118.38,11.43 119.65,12.7 119.65,100.33 118.38,101.6 115.84,101.6 114.57,100.33
RELAY1
  Top 0.35: R2.2 32.8,79.6 30.6,79.6 R1.1 30.4,79.6 28.6,79.6 27.6,80.6 14.4,80.6 5.4,71.6 U$1.XIAO_10
RELAY2
  Top 0.35: R6.2 32.8,64.4 30.6,64.4 R5.1 30.4,64.4 28.6,64.4 26.8,66.2 13.6,66.2 8,71.8 U$1.XIAO_11
RELAY3  (via drill 0.4)
  Top 0.35: R10.2 32.8,49 30.6,49 R9.1 30.4,49.2 28.6,49.2 26.8,51 24.8,51 21.4,54.4 21.4,63 18.8,65.6 13,65.6 v10.2,68.4
  Bottom 0.35: v10.2,68.4 10.2,71 10.4,71.2 10.4,71.6 U$1.XIAO_12
RELAY4  (via drill 0.4)
  Top 0.35: R14.2 32.8,33.8 30.6,33.8 R13.1 30.4,34 28.4,34 26.6,35.8 24.8,35.8 22,38.6 22,47.4 12,57.4 v12,65.4
  Bottom 0.35: v12,65.4 13.2,66.6 13.2,71 13,71.2 13,71.6 U$1.XIAO_13
RELAY5
  Top 0.35: R18.2 32.8,18.6 30.6,18.6 R17.1 30.4,18.6 28.6,18.6 26.6,20.6 25,20.6 21.4,24.2 21.4,32.8 10.2,44 10.2,65 4,71.2 4,78 12.8,86.8 U$1.XIAO_110
RELAY6  (via drill 0.4)
  Top 0.35: 31.6,3.2 32.8,3.2 R25.2 | 31.6,3.2 30.6,3.2 R24.1 | v31.6,4 31.6,3.2
  Bottom 0.35: v31.6,4 18.2,17.4 18.2,71.6 U$1.XIAO_15
ROUT1
  Top 1.5: K1.O2 79.21,82.35 F1.2
ROUT2
  Top 1.5: K2.O2 82.21,67.35 F2.2
ROUT3
  Top 1.5: K3.O2 79.21,52.35 F3.2
ROUT4
  Top 1.5: K4.O2 82.21,37.35 F4.2
ROUT5
  Top 1.5: K5.O2 79.21,22.35 F5.2
ROUT6
  Top 1.5: K6.M 81.21,8.35 F6.2
SENS1
  Top 0.35: R21.2 19.8,54.4 19.2,54.4 17.6,56 17.6,57.8 16.2,59.2 SENSOR1.P2
  Bottom 0.35: U$1.XIAO_18 16.8,85.75 16.8,61 16.2,60.4 16.2,59.4 SENSOR1.P2
SENS2  (via drill 0.4)
  Top 0.35: 17.9,42.9 16.8,44 16.2,44 SENSOR2.P2 | 17.9,42.9 19.8,41 R22.2 | 17.9,42.9 v19.4,44.4
  Bottom 0.35: v19.4,44.4 19.4,44.45 23.13,48.18 23.13,87.63 21.86,88.9 17.5,88.9 15.6,87 U$1.XIAO_19
SENS3
  Top 0.35: R23.2 19.8,24 19.4,24 17.6,25.8 17.6,27.4 16.2,28.8 SENSOR3.P2
  Bottom 0.35: U$1.XIAO_14 15.51,60.71 14.6,59.8 14.6,58.8 14.8,58.6 14.8,57.6 14.4,57.2 14.4,47.8 17.6,44.6 17.6,30.6 16.2,29.2 16.2,28.8 SENSOR3.P2

### Text on the board
tPlace: + | + | + | + | + | + | + | + | + | + | + | + | +
bPlace: 3V3 | SIG | GND | 3V3 | SIG | GND | 3V3 | SIG | GND
tNames: N | ACDC | MAIN | L1 | N | Relay1 | L1 | N | Relay2 | L1 | N | SENSOR1 | Relay3 | L1 | N | SENSOR2 | L1 | Relay4 | N | SENSOR3 | Relay5 | L1 | Relay6